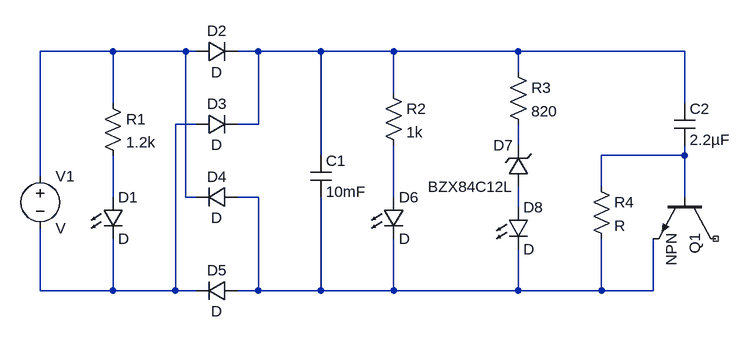
[diagram p0: schematic Draft1333.asc]
Draft1333.asc, the LTspice schematic file:
Version 4
SHEET 1 1060 680
WIRE 96 -128 -16 -128
WIRE 208 -128 96 -128
WIRE 224 -128 208 -128
WIRE 320 -128 288 -128
WIRE 416 -128 320 -128
WIRE 528 -128 416 -128
WIRE 720 -128 528 -128
WIRE 976 -128 720 -128
WIRE 720 -96 720 -128
WIRE 528 -64 528 -128
WIRE 96 -48 96 -128
WIRE 976 -48 976 -128
WIRE 224 -16 192 -16
WIRE 320 -16 320 -128
WIRE 320 -16 288 -16
WIRE 720 16 720 -16
WIRE 416 32 416 -128
WIRE 976 32 976 16
WIRE 976 32 848 32
WIRE -16 64 -16 -128
WIRE 848 80 848 32
WIRE 96 96 96 32
WIRE 208 96 208 -128
WIRE 224 96 208 96
WIRE 320 96 288 96
WIRE 528 96 528 16
WIRE 976 96 976 32
WIRE 720 112 720 80
WIRE -16 240 -16 144
WIRE 96 240 96 160
WIRE 96 240 -16 240
WIRE 192 240 192 -16
WIRE 192 240 96 240
WIRE 224 240 192 240
WIRE 320 240 320 96
WIRE 320 240 288 240
WIRE 416 240 416 96
WIRE 416 240 320 240
WIRE 528 240 528 160
WIRE 528 240 416 240
WIRE 720 240 720 176
WIRE 720 240 528 240
WIRE 848 240 848 160
WIRE 848 240 720 240
WIRE 928 240 928 160
WIRE 928 240 848 240
SYMBOL voltage -16 48 R0
SYMATTR InstName V1
SYMBOL res 80 -64 R0
SYMATTR InstName R1
SYMATTR Value 1.2k
SYMATTR SpiceLine tol=10 pwr=0.25
SYMBOL LED 80 96 R0
SYMATTR InstName D1
SYMBOL diode 224 -112 R270
WINDOW 0 32 32 VTop 2
WINDOW 3 0 32 VBottom 2
SYMATTR InstName D2
SYMBOL diode 224 0 R270
WINDOW 0 32 32 VTop 2
WINDOW 3 0 32 VBottom 2
SYMATTR InstName D3
SYMBOL diode 288 80 R90
WINDOW 0 0 32 VBottom 2
WINDOW 3 32 32 VTop 2
SYMATTR InstName D4
SYMBOL diode 288 224 R90
WINDOW 0 0 32 VBottom 2
WINDOW 3 32 32 VTop 2
SYMATTR InstName D5
SYMBOL cap 400 32 R0
SYMATTR InstName C1
SYMATTR Value 10mF
SYMATTR SpiceLine V=35V
SYMBOL res 512 -80 R0
SYMATTR InstName R2
SYMATTR Value 1k
SYMATTR SpiceLine tol=10 pwr=0.25
SYMBOL LED 512 96 R0
SYMATTR InstName D6
SYMBOL zener 736 80 R180
WINDOW 0 24 64 Left 2
WINDOW 3 24 0 Left 2
SYMATTR InstName D7
SYMATTR Value BZX84C12L
SYMATTR Description Diode
SYMATTR Type diode
SYMBOL LED 704 112 R0
SYMATTR InstName D8
SYMBOL res 704 -112 R0
SYMATTR InstName R3
SYMATTR Value 820
SYMATTR SpiceLine tol=10 pwr=0.25
SYMBOL cap 960 -48 R0
SYMATTR InstName C2
SYMATTR Value 2.2µF
SYMATTR SpiceLine V=16V
SYMBOL res 832 64 R0
SYMATTR InstName R4
SYMBOL npn3 1024 96 R90
SYMATTR InstName Q1

The netlist it stands for:
* Draft1333.asc
V1 N001 N003 V
R1 N001 N006 1.2k tol=10 pwr=0.25
D1 N006 N003 D
D2 N001 N002 D
D3 N003 N002 D
D4 N007 N001 D
D5 N007 N003 D
C1 N002 N007 10mF V=35V
R2 N002 N008 1k tol=10 pwr=0.25
D6 N008 N007 D
D7 N009 N004 BZX84C12L
D8 N009 N007 D
R3 N002 N004 820 tol=10 pwr=0.25
C2 N002 N005 2.2µF V=16V
R4 N005 N007 R
Q1 NC_01 N005 N007 0 NPN
.model D D
.lib standard.dio
.model NPN NPN
.model PNP PNP
.lib standard.bjt
.backanno
.end